# Altium schematic sheet System PMU pins.SchDoc
size A3; SheetNumber: 9; SheetTotal: 9
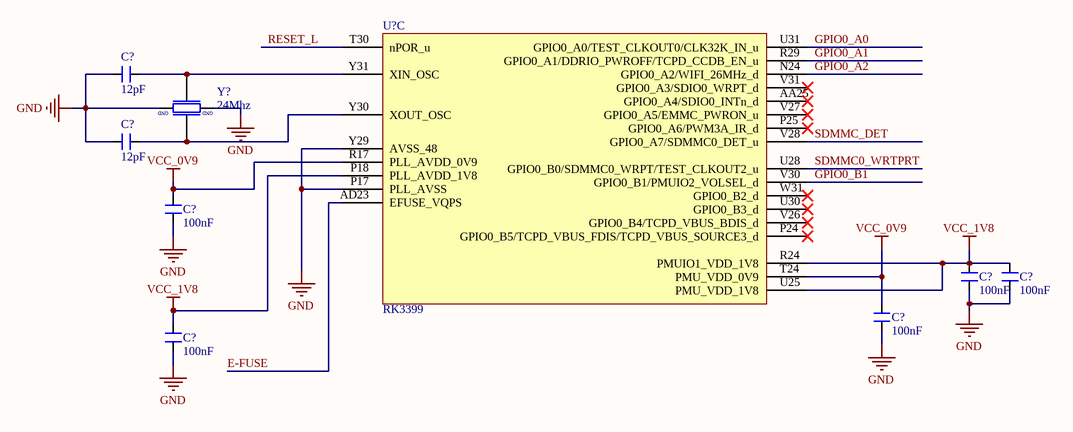
[diagram p0: System PMU pins.SchDoc]

## Parts
(Parts that share a designator on the sheet are numbered #1, #2 ... from top to bottom, then left to right.)
C?#1  12pF  [CAP_0201]
C?#2  12pF  [CAP_0201]
C?#3  100nF  [CAP_0201]
C?#4  100nF  [CAP_0201]
C?#5  100nF  [CAP_0201]
C?#6  100nF  [CAP_0201]
C?#7  100nF  [CAP_0201]
U?  RK3399  [BGA828_RK3399]  (part C of 24)
Y?  24Mhz  [XTAL_ABM8AIG-24.000MHZ-12-2Z-T3]

## Nets
GND: C?#1.2 C?#2.2 C?#3.1 C?#4.1 C?#5.1 C?#6.1 C?#7.1 U?.P17(PLL_AVSS) U?.Y29(AVSS_48) Y?.2 Y?.4
VCC_0V9: C?#3.2 C?#6.2 U?.R17(PLL_AVDD_0V9) U?.T24(PMU_VDD_0V9)
VCC_1V8: C?#4.2 C?#5.2 C?#7.2 U?.P18(PLL_AVDD_1V8) U?.R24(PMUIO1_VDD_1V8) U?.U25(PMU_VDD_1V8)
E-FUSE: U?.AD23(EFUSE_VQPS)
GPIO0_A0: U?.U31(GPIO0_A0/TEST_CLKOUT0/CLK32K_IN_u)
GPIO0_A1: U?.R29(GPIO0_A1/DDRIO_PWROFF/TCPD_CCDB_EN_u)
GPIO0_A2: U?.N24(GPIO0_A2/WIFI_26MHz_d)
GPIO0_B1: U?.V30(GPIO0_B1/PMUIO2_VOLSEL_d)
RESET_L: U?.T30(nPOR_u)
SDMMC0_WRTPRT: U?.U28(GPIO0_B0/SDMMC0_WRPT/TEST_CLKOUT2_u)
SDMMC_DET: U?.V28(GPIO0_A7/SDMMC0_DET_u)
NetC?#1_1: C?#1.1 U?.Y31(XIN_OSC) Y?.3
NetC?#2_1: C?#2.1 U?.Y30(XOUT_OSC) Y?.1

Not connected (* = marked no-connect by the designer): U? AA25(GPIO0_A4/SDIO0_INTn_d)* P24(GPIO0_B5/TCPD_VBUS_FDIS/TCPD_VBUS_SOURCE3_d)* P25(GPIO0_A6/PWM3A_IR_d)* U30(GPIO0_B3_d)* V26(GPIO0_B4/TCPD_VBUS_BDIS_d)* V27(GPIO0_A5/EMMC_PWRON_u)* V31(GPIO0_A3/SDIO0_WRPT_d)* W31(GPIO0_B2_d)*

## Notes on the sheet
- (in symbol XTAL_24Mhz-12pF-4-SMD) GND

## Library data of the parts
C?#1 C?#2 = CAP_12pF-16V-10%-0201: Capacitor SMD Ceramic 0201 Case 16Vdc C0G (NP0) Dielectric 12pF ±10% ø7T/R"; Manufacturer: AVX Corporation; Manufacturer Part Number: 0201YA120KAT2A; Manufacturer 1: Kyocera AVX; Voltage Rating: 16V; Case/Package: 0201; Supplier-1: Digikey; Supplier 1: Digi-Key; Manufacturer Part Number 1: 0201YA120KAT2A; RoHS: Yes; Category: Ceramic Capacitors; Pricing 1: 15000=0.06696 (USD); Mount: Surface Mount; Number of Pins: 2; Case Code (Imperial): 0201; Case Code (Metric): 0603; Min Operating Temperature: -55°C; Max Operating Temperature: 125°C; Packaging: Tape and Reel; Capacitance: 12pF; Tolerance: 10%; Package Quantity: 15000; Voltage Rating (DC): 16V; Dielectric: C0G; Termination: SMD/SMT; Series: -; Construction: Flat; Length: 0.6mm; Width: 0.3mm; Depth: 0.3mm; Radiation Hardening: No; RoHS Compliant: Yes; ComponentLink1URL: https://datasheet.ciiva.com/13269/ccog-243403-13269830.pdf?src-supplier=Mouser; ComponentLink1Description: https://datasheet.ciiva.com/13269/ccog-243403-13269830.pdf?src-supplier=Mouser; ComponentLink2URL: https://datasheet.ciiva.com/208/ccog-208350.pdf?src-supplier=Digi-Key; ComponentLink2Description: https://datasheet.ciiva.com/208/ccog-208350.pdf?src-supplier=Digi-Key; Supplier Part Number 1: 0201YA120KAT2A-ND
C?#3-C?#7 = CAP_100nF-25V-10%-0201: Multilayer Ceramic Capacitor, 0.1 uF, 25 V, ± 10%, X5R, 0201 [0603 Metric]; Manufacturer: TDK Corporation; Manufacturer Part Number: C0603X5R1E104K030BB; Manufacturer 1: TDK; Voltage Rating: 25V; Case/Package: 0201; Supplier-1: Digikey; Supplier 1: Digi-Key; Manufacturer Part Number 1: C0603X5R1E104K030BB; RoHS: Yes; Category: Ceramic Capacitors; Stock 1: 525939; Pricing 1: 1=0.1, 10=0.069, 50=0.0376, 100=0.0307, 500=0.02192, 1000=0.01722, 2500=0.01566, 5000=0.0144 (USD); Mount: Surface Mount; Case Code (Metric): 0603; Case Code (Imperial): 0201; Weight: 6E-06oz; Dielectric Material: Ceramic; Min Operating Temperature: -55°C; Max Operating Temperature: 85°C; Package Quantity: 15000; Packaging: Tape and Reel; Capacitance: 100nF; Tolerance: 10%; Dielectric: X5R; Termination: SMD/SMT; Voltage Rating (DC): 25V; Series: C; Length: 0.6mm; Width: 0.3mm; Height: 0.3mm; Depth: 0.3mm; Reach SVHC Compliant: No; Lead Free: Lead Free; RoHS Compliant: Yes; ComponentLink1URL: https://datasheet.ciiva.com/14915/tdkmlcccaprange-14915358.pdf?src-supplier=Digi-Key; ComponentLink1Description: https://datasheet.ciiva.com/14915/tdkmlcccaprange-14915358.pdf?src-supplier=Digi-Key; Supplier Part Number 1: 445-13671-1-ND
U? = IC_RK3399-FCBGA828: RK3399 is a low power, high performance processor for computing, personal mobile.; Manufacturer: Rockchip; Manufacturer Part Number: RK3399; Case/Package: FCBGA828; Supplier-1: Rockchip
Y? = XTAL_24Mhz-12pF-4-SMD: 24MHz ±20ppm Crystal 12pF 50 Ohms 4-SMD, No Lead /; Manufacturer: Abracon LLC; Manufacturer Part Number: ABM8AIG-24.000MHZ-12-2Z-T3; Case/Package: SMD; Supplier-1: Digikey